# Altium schematic sheet LPS.SchDoc
size A4; SheetNumber: 6; SheetTotal: 7
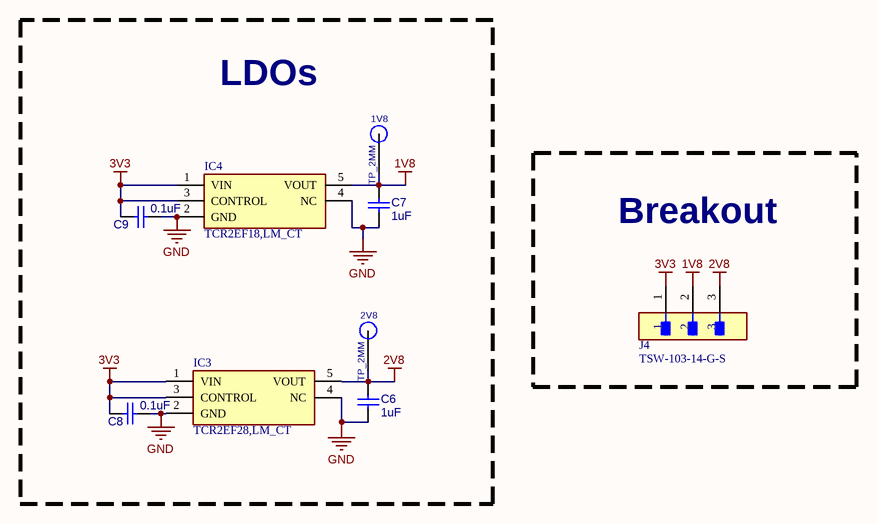
[diagram p0: LPS.SchDoc]

## Parts
1V8  TP_2MM  [TESTPOINT 2MM]
2V8  TP_2MM  [TESTPOINT 2MM]
C6  value 1uF  [C0603]  (hidden comment: MCD-00237)
C7  value 1uF  [C0603]  (hidden comment: MCD-00237)
C8  value 0.1uF  [C0603]  (hidden comment: MCD-00237)
C9  value 0.1uF  [C0603]  (hidden comment: MCD-00237)
IC3  TCR2EF28,LM_CT  [TCR2EF28LMCT]
IC4  TCR2EF18,LM_CT  [TCR2EF18LMCT]
J4  TSW-103-14-G-S  [FP-TSW-103-14-G-S-MFG]

## Blocks framed on the sheet
LDOs: 1V8 2V8 C6-C9 IC3 IC4
Breakout: J4

## Nets
1V8: 1V8.TP(TP_2MM) C7.1 IC4.5(VOUT) J4.2
2V8: 2V8.TP(TP_2MM) C6.1 IC3.5(VOUT) J4.3
3V3: C8.2 C9.2 IC3.1(VIN) IC3.3(CONTROL) IC4.1(VIN) IC4.3(CONTROL) J4.1
GND: C6.2 C7.2 C8.1 C9.1 IC3.2(GND) IC3.4(NC) IC4.2(GND) IC4.4(NC)

## Library data of the parts
C6-C9 = CMP-112-000001-1: Capacitor, MLCC, 100nF, 6V3, X5R, 10%, 0603, T=0,8mm; Manufacturer Part Number: CC0603KRX5R5BB104; Manufacturer: YAGEO; ECCN_EU: NEC; Provided_By: SUBCO; ECCN_US: EAR99; Status: Released; ComponentLink1Description: Datasheet; Component Type: Capacitors; Pin Count: 2; Package: C0603; Source: MB1364.SCHLIB; Design Item ID: MCD-00237; Part_Type: Capacitor; Internal_Part_Number: MCD-00237; ComponentLink1URL: http://tunmcdsvn.tun.st.com/Component_Datasheet_Library/Trunk/Capacitors/Yageo_Multilayer_capacitor_X5R_series_100pF_to_100uF; Manufacturer_Part_Number: CC0603KRX5R5BB104
IC3 = TCR2EF28,LM_CT: Integrated Circuit; Manufacturer_Name: Toshiba; Manufacturer_Part_Number: TCR2EF28,LM(CT; Datasheet Link: https://toshiba.semicon-storage.com/info/docget.jsp?did=13794&prodName=TCR2EF28; Height: 1.4mm; Mouser Part Number: 757-TCR2EF28LMCT; Mouser Price/Stock: https://www.mouser.co.uk/ProductDetail/Toshiba/TCR2EF28LMCT?qs=cW4DzVrAanOy43sfBSrpyQ%3D%3D; Arrow Part Number: TCR2EF28,LM(CT; Arrow Price/Stock: https://www.arrow.com/en/products/tcr2ef28lm-ct/toshiba?utm_currency=USD&region=nac
IC4 = TCR2EF18,LM_CT: Integrated Circuit; Manufacturer_Name: Toshiba; Manufacturer_Part_Number: TCR2EF18,LM(CT; Datasheet Link: https://toshiba.semicon-storage.com/info/TCR2EF18_datasheet_ja_20200507.pdf?did=13793&prodName=TCR2EF18; Height: 1.4mm; Mouser Part Number: 757-TCR2EF18LMCT; Mouser Price/Stock: https://www.mouser.co.uk/ProductDetail/Toshiba/TCR2EF18LMCT?qs=EPmvyOv1YlMU%252B9uLgN8FiA%3D%3D; Arrow Part Number: TCR2EF18,LM(CT; Arrow Price/Stock: http://www.arrow.com/en/products/tcr2ef18lm-ct/toshiba
J4 = CMP-02766-001743-1: CONN HEADER VERT 3POS 2.54MM; Max Voltage Rating (AC): 550V; Number of Positions: 3; Max Current Rating: 7.6A; Gender: Male; Termination: Solder; RoHS Compliant: Yes; Mount: Through Hole; Lead Free: Lead Free; Connector Type: Header; REACH SVHC: No SVHC; Insulation Color: Black; Width: 2.54mm; Length: 7.62mm; Flammability Rating: UL94 V-0; Housing Material: Polyester; Contact Material: Bronze; Max Operating Temperature: 125°C; Fastening Type: Pull; Series: TSW; Number of Contacts: 3; Packaging: Bulk; Min Operating Temperature: -55°C; Package Quantity: 1; Height: 10.67mm; Pitch: 2.54mm; Contact Finish - Mating: GOLD; Contact Type: Male Pin; Radiation Hardening: No; Color: Black; Housing Color: Black; Contact Plating: Gold; Orientation: Straight; Number of Rows: 1; Depth: 2.54mm; Insulation Material: PBT; Contact Mating Length: 0.32inch; Contact Shape: Square